# Altium schematic sheet Backlight.SchDoc
size A4
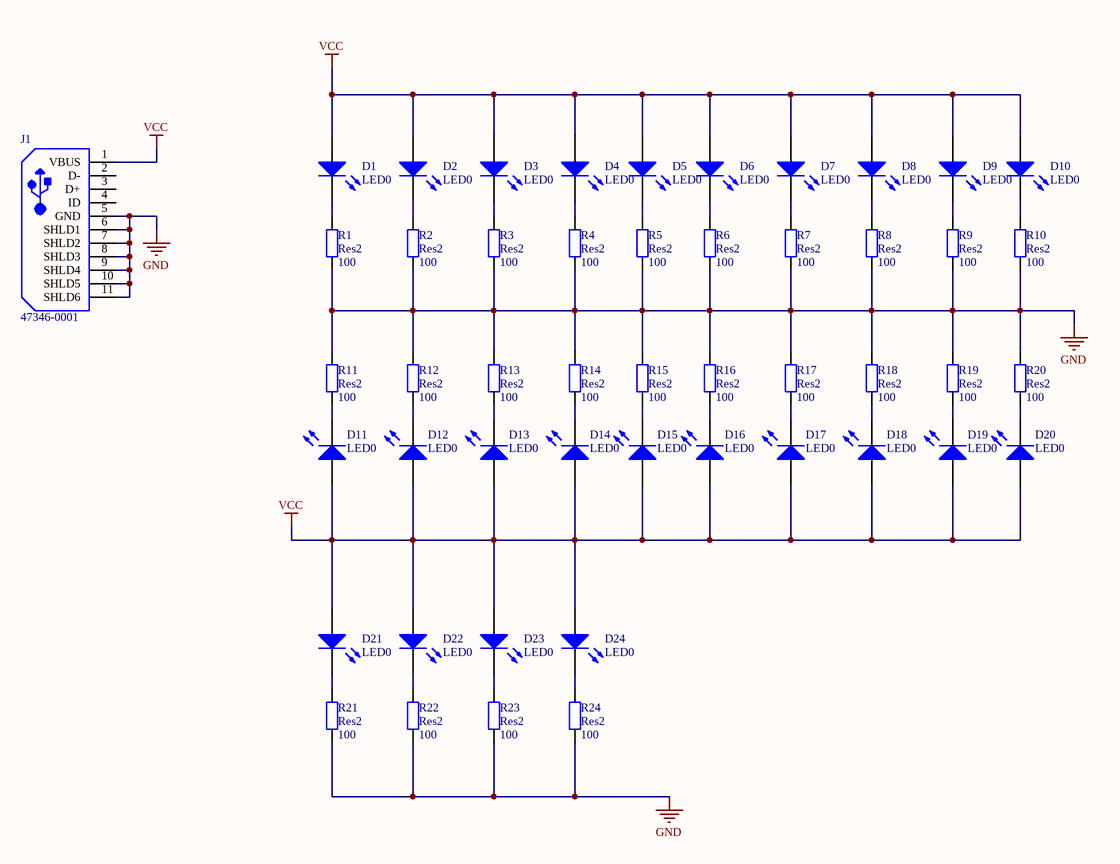
[diagram p0: Backlight.SchDoc]

## Parts
D1  LED0  [DIOC2012X06N]
D2  LED0  [DIOC2012X06N]
D3  LED0  [DIOC2012X06N]
D4  LED0  [DIOC2012X06N]
D5  LED0  [DIOC2012X06N]
D6  LED0  [DIOC2012X06N]
D7  LED0  [DIOC2012X06N]
D8  LED0  [DIOC2012X06N]
D9  LED0  [DIOC2012X06N]
D10  LED0  [DIOC2012X06N]
D11  LED0  [DIOC2012X06N]
D12  LED0  [DIOC2012X06N]
D13  LED0  [DIOC2012X06N]
D14  LED0  [DIOC2012X06N]
D15  LED0  [DIOC2012X06N]
D16  LED0  [DIOC2012X06N]
D17  LED0  [DIOC2012X06N]
D18  LED0  [DIOC2012X06N]
D19  LED0  [DIOC2012X06N]
D20  LED0  [DIOC2012X06N]
D21  LED0  [DIOC2012X06N]
D22  LED0  [DIOC2012X06N]
D23  LED0  [DIOC2012X06N]
D24  LED0  [DIOC2012X06N]
J1  47346-0001  [MOLX-47346-0001-5_V]
R1  Res2  value 100  [RESC2012X06N]
R2  Res2  value 100  [RESC2012X06N]
R3  Res2  value 100  [RESC2012X06N]
R4  Res2  value 100  [RESC2012X06N]
R5  Res2  value 100  [RESC2012X06N]
R6  Res2  value 100  [RESC2012X06N]
R7  Res2  value 100  [RESC2012X06N]
R8  Res2  value 100  [RESC2012X06N]
R9  Res2  value 100  [RESC2012X06N]
R10  Res2  value 100  [RESC2012X06N]
R11  Res2  value 100  [RESC2012X06N]
R12  Res2  value 100  [RESC2012X06N]
R13  Res2  value 100  [RESC2012X06N]
R14  Res2  value 100  [RESC2012X06N]
R15  Res2  value 100  [RESC2012X06N]
R16  Res2  value 100  [RESC2012X06N]
R17  Res2  value 100  [RESC2012X06N]
R18  Res2  value 100  [RESC2012X06N]
R19  Res2  value 100  [RESC2012X06N]
R20  Res2  value 100  [RESC2012X06N]
R21  Res2  value 100  [RESC2012X06N]
R22  Res2  value 100  [RESC2012X06N]
R23  Res2  value 100  [RESC2012X06N]
R24  Res2  value 100  [RESC2012X06N]

## Nets
GND: J1.5(GND) J1.6(SHLD1) J1.7(SHLD2) J1.8(SHLD3) J1.9(SHLD4) J1.10(SHLD5) J1.11(SHLD6) R1.1 R2.1 R3.1 R4.1 R5.1 R6.1 R7.1 R8.1 R9.1 R10.1 R11.1 R12.1 R13.1 R14.1 R15.1 R16.1 R17.1 R18.1 R19.1 R20.1 R21.1 R22.1 R23.1 R24.1
VCC: D1.1(A) D2.1(A) D3.1(A) D4.1(A) D5.1(A) D6.1(A) D7.1(A) D8.1(A) D9.1(A) D10.1(A) D11.1(A) D12.1(A) D13.1(A) D14.1(A) D15.1(A) D16.1(A) D17.1(A) D18.1(A) D19.1(A) D20.1(A) D21.1(A) D22.1(A) D23.1(A) D24.1(A) J1.1(VBUS)
NetD1_2: D1.2(K) R1.2
NetD2_2: D2.2(K) R2.2
NetD3_2: D3.2(K) R3.2
NetD4_2: D4.2(K) R4.2
NetD5_2: D5.2(K) R5.2
NetD6_2: D6.2(K) R6.2
NetD7_2: D7.2(K) R7.2
NetD8_2: D8.2(K) R8.2
NetD9_2: D9.2(K) R9.2
NetD10_2: D10.2(K) R10.2
NetD11_2: D11.2(K) R11.2
NetD12_2: D12.2(K) R12.2
NetD13_2: D13.2(K) R13.2
NetD14_2: D14.2(K) R14.2
NetD15_2: D15.2(K) R15.2
NetD16_2: D16.2(K) R16.2
NetD17_2: D17.2(K) R17.2
NetD18_2: D18.2(K) R18.2
NetD19_2: D19.2(K) R19.2
NetD20_2: D20.2(K) R20.2
NetD21_2: D21.2(K) R21.2
NetD22_2: D22.2(K) R22.2
NetD23_2: D23.2(K) R23.2
NetD24_2: D24.2(K) R24.2

Not connected (* = marked no-connect by the designer): J1 2(D-) 3(D+) 4(ID)

## Library data of the parts
D1-D24 = LED0: Typical INFRARED GaAs LED; Published: 8-Jun-2000; LatestRevisionDate: 08-Jul-2005; LatestRevisionNote: Mech Layer 1 removed.; PackageReference: LED-0; Publisher: Altium Limited; PackageDescription: LED; 2 Leads
J1 = CMP-2000-05246-1: Micro-USB B Receptacle with Flange, -30 to 85 degC, 5-Pin SMD, RoHS, Tape and Reel; Manufacturer: Molex; Number of Contacts: 5; Body Orientation: RightAngle; Maximum Voltage Rating: 30VAC; Pitch: 0.65mm; Maximum Current Rating: 1.8/ContactA; Number of Ports: 1; Gender: RCP; Operating Temperature: -30to85C; Part No: 47346-0001; Color: Black; Termination Method: Solder; Contact Plating: GoldOverPalladiumNickelOverNickel; Dimension: 7.8x5.43x2.94mm; Number of Terminals: 5; Datasheet Version: Dec-13; Datasheet URL: https://datasheet.ciiva.com/30075/304740473460001-io-nectors-30075527.pdf; Contact Material: CopperAlloy; RoHS: Yes; Housing Material: LiquidCrystalPolymer; Manufacturer URL: http://www.molex.com/; Packaging: EmbossedTapeandReel; Mounting: SurfaceMount; Type: MicroUSBTypeB
R1-R24 = Res2: Resistor; Published: 8-Jun-2000; LatestRevisionDate: 17-Jul-2002; LatestRevisionNote: Re-released for DXP Platform.; PackageReference: AXIAL-0.4; Publisher: Altium Limited; PackageDescription: Axial Device, Thru-Hole; 2 Leads; 0.4 in Pin Spacing